# EAGLE design Contatore a relay 3bit - Product (EAGLE 9.6.2)
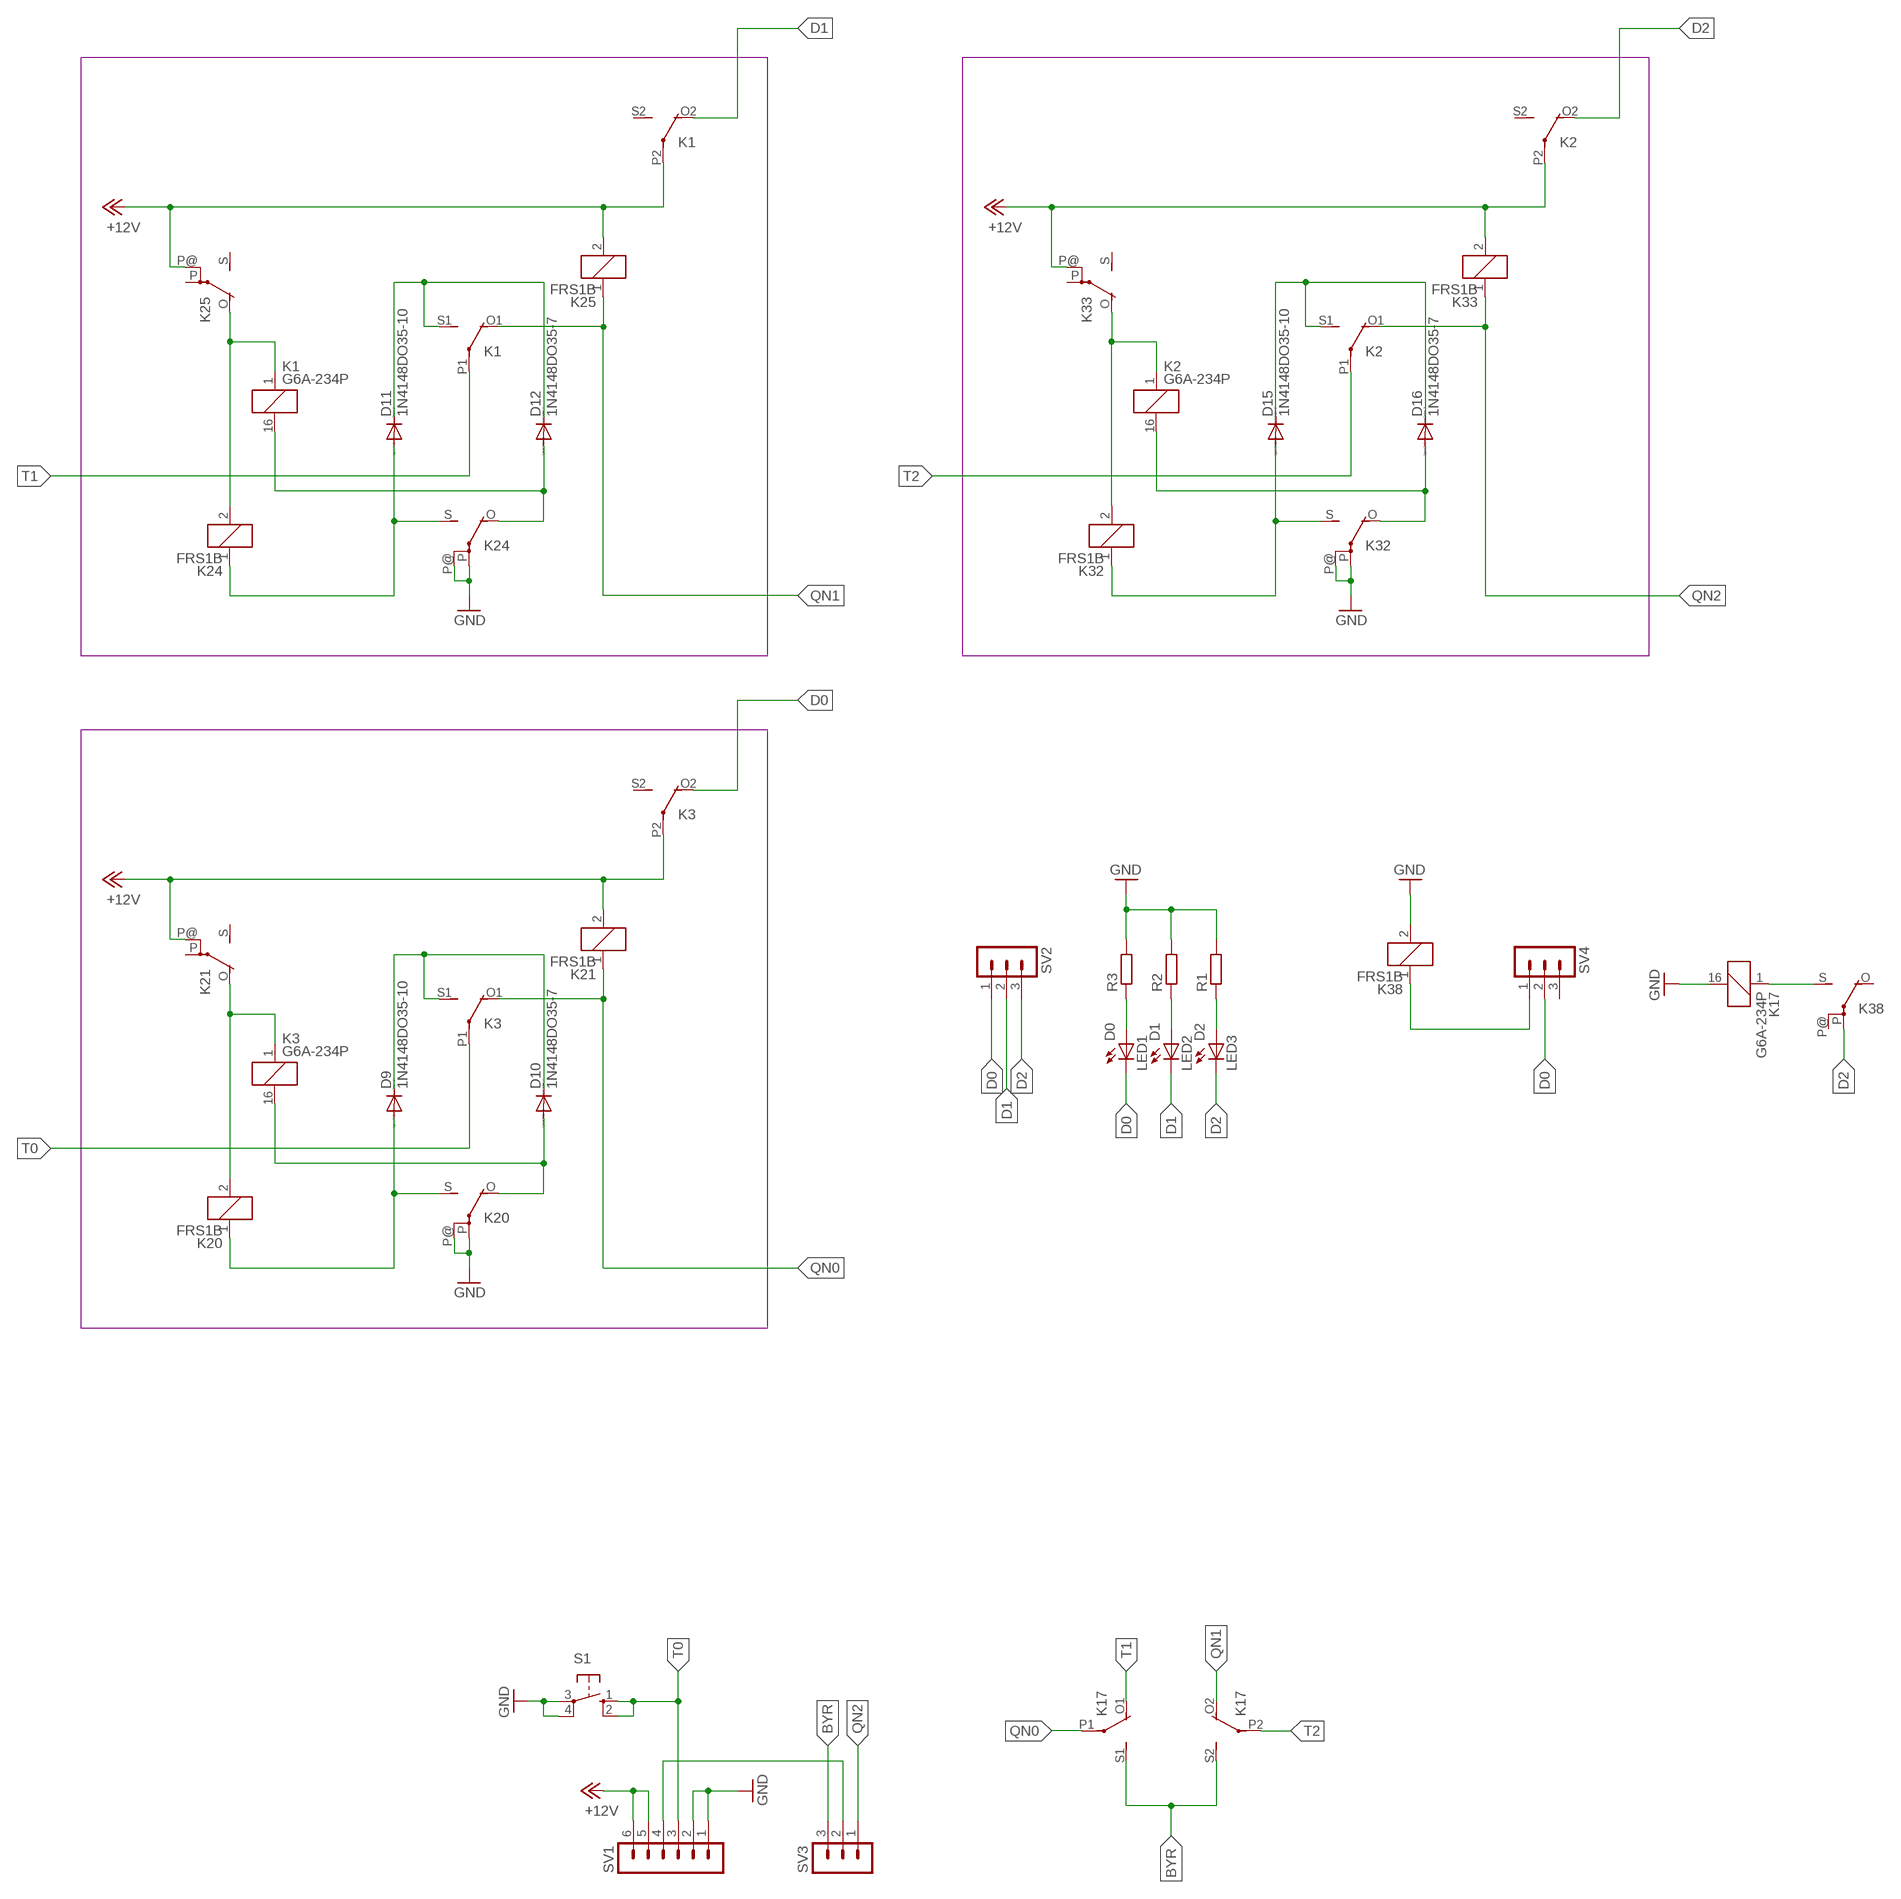
[diagram p0: schematic, sheet 1]

## Parts
D9  1N4148DO35-10  [DO35-10]
D10  1N4148DO35-7  [DO35-7]
D11  1N4148DO35-10  [DO35-10]
D12  1N4148DO35-7  [DO35-7]
D15  1N4148DO35-10  [DO35-10]
D16  1N4148DO35-7  [DO35-7]
K1  G6A-234P  [G6A-234P]
K2  G6A-234P  [G6A-234P]
K3  G6A-234P  [G6A-234P]
K17  G6A-234P  [G6A-234P]
K20  FRS1B  [FRS1B]
K21  FRS1B  [FRS1B]
K24  FRS1B  [FRS1B]
K25  FRS1B  [FRS1B]
K32  FRS1B  [FRS1B]
K33  FRS1B  [FRS1B]
K38  FRS1B  [FRS1B]
LED1  D0  LED3MM  [LED3MM]
LED2  D1  LED3MM  [LED3MM]
LED3  D2  LED3MM  [LED3MM]
R1  R-EU_M0805  [M0805]
R2  R-EU_M0805  [M0805]
R3  R-EU_M0805  [M0805]
S1  10-XX  [B3F-10XX]
SV1  MA06-1  [MA06-1]
SV2  MA03-1  [MA03-1]
SV3  MA03-1  [MA03-1]
SV4  MA03-1  [MA03-1]

## Nets
+12V: K1.P2(3:P) K2.P2(3:P) K3.P2(3:P) K21.2 K21.P@(2:P) K25.2 K25.P@(2:P) K33.2 K33.P@(2:P) SV1.5 SV1.6
BYR: K17.S1(2:S) K17.S2(3:S) SV3.3
D0: K3.O2(3:O) LED1.K(C) SV2.1 SV4.2
D1: K1.O2(3:O) LED2.K(C) SV2.2
D2: K2.O2(3:O) K38.P(2:P) LED3.K(C) SV2.3
GND: K17.16 K20.P(2:P) K20.P@(2:P) K24.P(2:P) K24.P@(2:P) K32.P(2:P) K32.P@(2:P) K38.2 R1.2 R2.2 R3.2 S1.3(P) S1.4(P1) SV1.1 SV1.2
N$1: SV1.4 SV3.2
N$2: K38.1 SV4.1
N$35: D10.A K3.16 K20.O(2:O)
N$36: D9.A K20.1 K20.S(2:S)
N$37: K3.1 K20.2 K21.O(2:O)
N$40: D9.C D10.C K3.S1(2:S)
N$42: D12.A K1.16 K24.O(2:O)
N$43: D11.A K24.1 K24.S(2:S)
N$44: K1.1 K24.2 K25.O(2:O)
N$47: D11.C D12.C K1.S1(2:S)
N$55: D16.A K2.16 K32.O(2:O)
N$56: D15.A K32.1 K32.S(2:S)
N$57: K2.1 K32.2 K33.O(2:O)
N$58: D15.C D16.C K2.S1(2:S)
N$61: K17.1 K38.S(2:S)
N$64: LED1.A R3.1
N$65: LED2.A R2.1
N$67: LED3.A R1.1
QN0: K3.O1(2:O) K17.P1(2:P) K21.1
QN1: K1.O1(2:O) K17.O2(3:O) K25.1
QN2: K2.O1(2:O) K33.1 SV3.1
T0: K3.P1(2:P) S1.1(S) S1.2(S1) SV1.3
T1: K1.P1(2:P) K17.O1(2:O)
T2: K2.P1(2:P) K17.P2(3:P)
Unconnected: K1.S2(3:S) K2.S2(3:S) K3.S2(3:S) K21.P(2:P) K21.S(2:S) K25.P(2:P) K25.S(2:S) K33.P(2:P) K33.S(2:S) K38.O(2:O) K38.P@(2:P) SV4.3

## Library data of the parts
D9-D12 D15 D16 = diode:1N4148: DIODE high speed (Philips)
K1-K3 K17 = relay:G6A-234P: RELAY 2 x switch, 0.3 A/125 V AC, 1 A/30 V DC, Omron; OC_FARNELL: unknown; OC_NEWARK: unknown
K20 K21 K24 K25 K32 K33 K38 = relay:FRS1B: RELAY 1 x switch, same as V23101-D6-A201, Siemens; OC_FARNELL: unknown; OC_NEWARK: unknown
LED1-LED3 = led:LED: LED OSRAM: - CHIPLED LG R971, LG N971, LY N971, LG Q971, LY Q971, LO R971, LY R971 LH N974, LH R974 LS Q976, LO Q976, LY Q976 LO Q996 - Hyper CHIPLED LW Q18S LB Q993, LB Q99A, LB R99A - SideLED LS A670, LO A670, LY A670, LG A670, LP A670 LB A673, LV A673, LT A673, LW A673 LH A674 LY A675 LS A676, LA A676, LO A676, LY A676, LW A676 LS A679, LY A679, LG A679 - Hyper Micro SIDELED® LS Y876, LA Y876, LO Y876, LY Y876 LT Y87S - SmartLED LW L88C, LW L88S LB L89C, LB L89S, LG L890 LS L89K, LO L89K, LY L89K LS L896, LA L896, LO L896, LY L896 - TOPLED LS T670, LO T670, LY T670, LG T670, LP T670 LSG T670, LSP T670, LSY T670, LOP T670, LYG T670 LG T671, LOG T671, LSG T671 LB T673, LV T673, LT T673, LW T673 LH T674 LS T676, LA T676, LO T676, LY T676, LB T676, LH T676, LSB T676, LW T676 LB T67C, LV T67C, LT T67C, LS T67K, LO T67K, LY T67K, LW E67C LS E67B, LA E67B, LO E67B, LY E67B, LB E67C, LV E67C, LT E67C LW T67C LS T679, LY T679, LG T679 LS T770, LO T770, LY T770, LG T770, LP T770 LB T773, LV T773, LT T773, LW T773 LH T774 LS E675, LA E675, LY E675, LS T675 LS T776, LA T776, LO T776, LY T776, LB T776 LHGB T686 LT T68C, LB T68C - Hyper Mini TOPLED® LB M676 - Mini TOPLED Santana® LG M470 LS M47K, LO M47K, LY M47K Source: http://www.osram.convergy.de LUXEON: - LUMILED® LXK2-PW12-R00, LXK2-PW12-S00, LXK2-PW14-U00, LXK2-PW14-V00 LXK2-PM12-R00, LXK2-PM12-S00, LXK2-PM14-U00 LXK2-PE12-Q00, LXK2-PE12-R00, LXK2-PE12-S00, LXK2-PE14-T00, LXK2-PE14-U00 LXK2-PB12-K00, LXK2-PB12-L00, LXK2-PB12-M00, LXK2-PB14-N00, LXK2-PB14-P00, LXK2-PB14-Q00 LXK2-PR12-L00, LXK2-PR12-M00, LXK2-PR14-Q00, LXK2-PR14-R00 LXK2-PD12-Q00, LXK2-PD12-R00, LXK2-PD12-S00 LXK2-PH12-R00, LXK2-PH12-S00 LXK2-PL12-P00, LXK2-PL12-Q00, LXK2-PL12-R00 Source: www.luxeon.com KINGBRIGHT: KA-3528ASYC Source: www.kingbright.com
R1-R3 = rcl:R-EU_: RESISTOR, European symbol
S1 = switch-omron:10-XX: OMRON SWITCH; MPN: B3F-1000; OC_FARNELL: 176432; OC_NEWARK: 36M3542
SV1 = con-lstb:MA06-1: PIN HEADER; OC_FARNELL: unknown; OC_NEWARK: unknown
SV2-SV4 = con-lstb:MA03-1: PIN HEADER; OC_FARNELL: unknown; OC_NEWARK: unknown

## Board
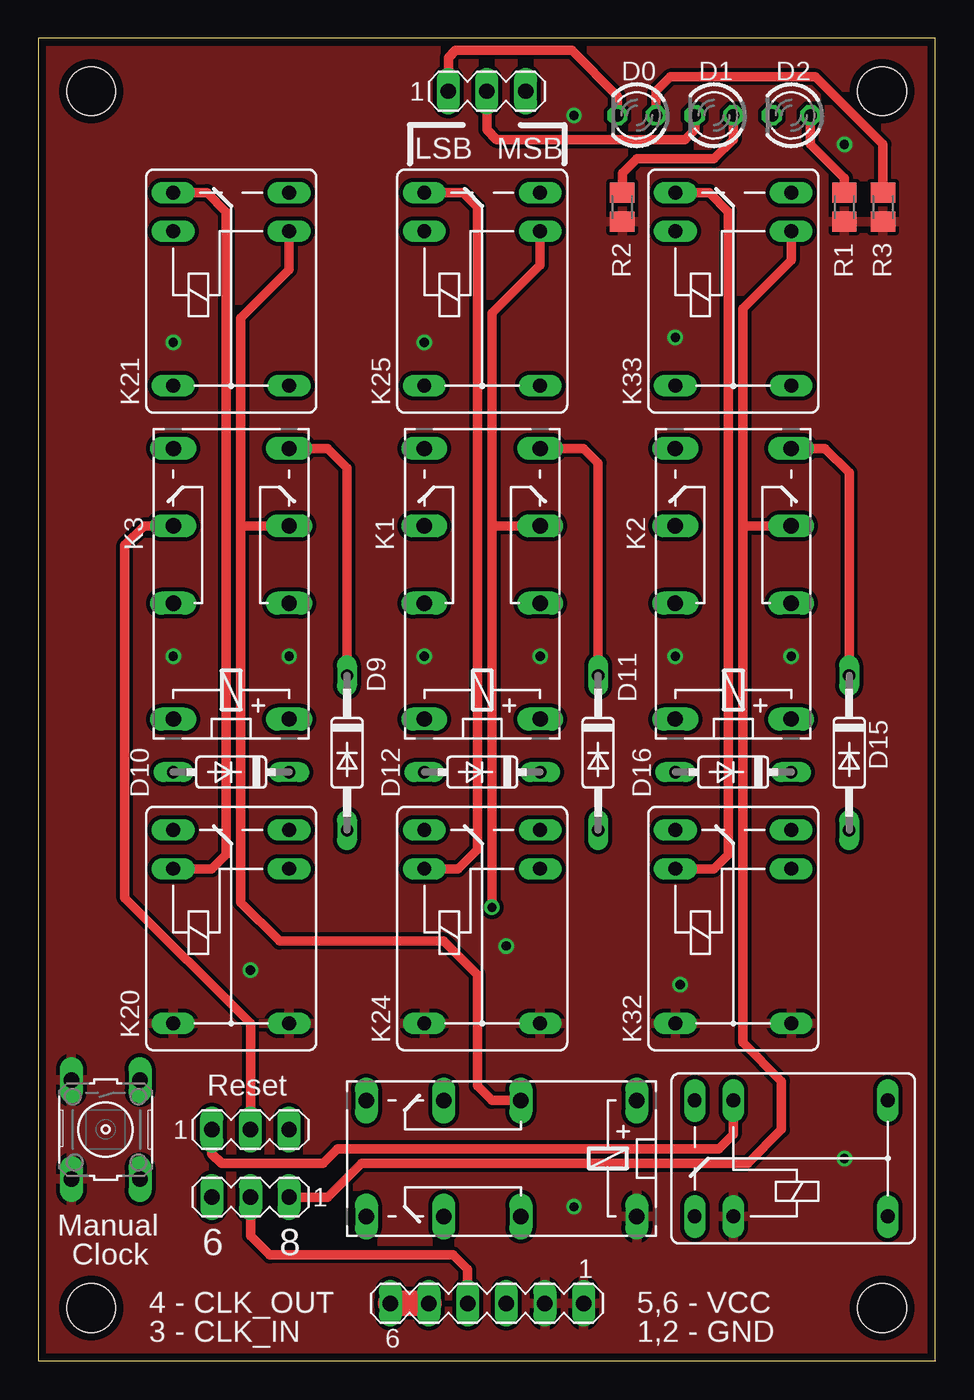
[diagram p1: board, top side]
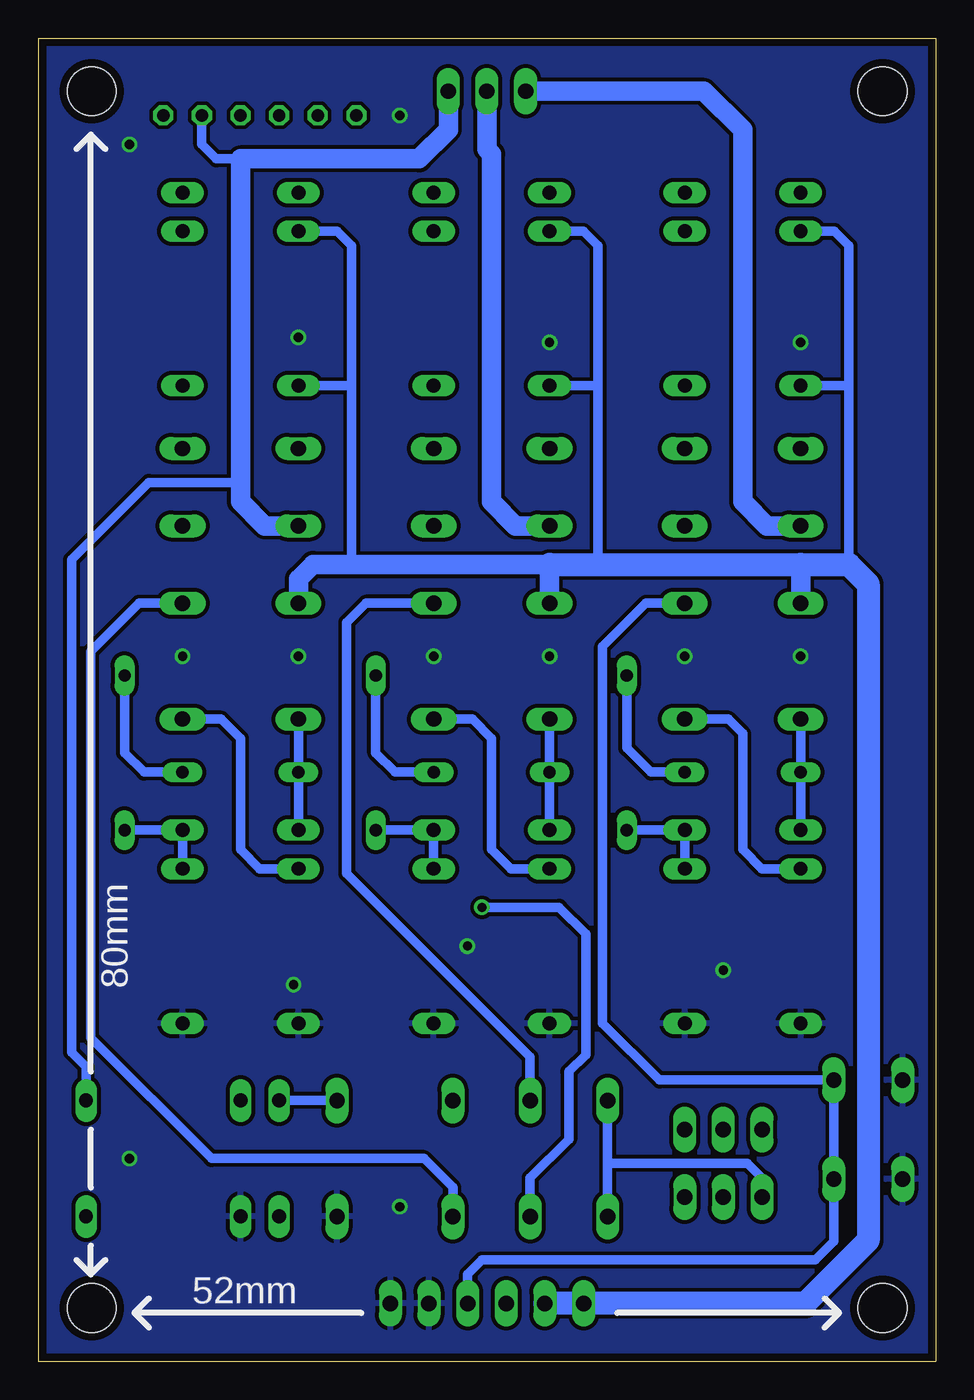
[diagram p2: board, bottom side, seen from below]

Size 59.03 x 87.01 mm. Coordinates in mm from the lower left corner, seen from the top.
Outline: 59,0.01 59,87.01 0,87.01 0,0.01
Outline: 59.03,0 0,0
Copper layers (1*16): Top 0.035mm / dielectric 1.5mm / Bottom 0.035mm
Design rules "default *": minimum track width 10mil, minimum drill 24mil, track to track 8mil, track to pad 8mil, pad to pad 8mil, via to via 8mil, smd to smd 8mil, copper to edge 20mil, drill to drill 8mil, minimum pad ring 10mil, minimum via ring 8mil, stop-mask expansion 4mil, vias tented up to drill 0mil, thermal gap 10mil
Holes 3.2 mm at 3.5,3.51 55.5,3.51 55.5,83.51 3.5,83.51

### Footprints (pad centres in the part's own frame; a part is rotated, then mirrored left to right if it is on the bottom)
DO35-10 = drill 0.813 long: A 5.08,0; C -5.08,0
DO35-7 = drill 0.813 long: A 3.81,0; C -3.81,0
G6A-234P = drill 1.016 long: 1 -3.81,-3.81; 16 -3.81,3.81; O1 8.89,-3.81; O2 8.89,3.81; P1 3.81,-3.81; P2 3.81,3.81; S1 13.97,-3.81; S2 13.97,3.81
FRS1B = drill 0.914 long: 1 0,3.81; 2 0,-3.81; O -2.54,-3.81; P 10.16,3.81; P@ 10.16,-3.81; S -2.54,3.81
LED3MM = drill 0.813 octagon: A -1.27,0; K 1.27,0
M0805 = smd 1.3 x 1.6: 1 -0.95,0; 2 0.95,0
B3F-10XX = drill 1.016 long: 1 -3.251,2.261; 2 3.251,2.261; 3 -3.251,-2.261; 4 3.251,-2.261
MA06-1 = drill 1.016 long: 1 -6.35,0; 2 -3.81,0; 3 -1.27,0; 4 1.27,0; 5 3.81,0; 6 6.35,0
MA03-1 = drill 1.016 long: 1 -2.54,0; 2 0,0; 3 2.54,0

### Placement (x,y rotation side)
D9  20.32,40.02 270 top
D10  12.7,38.75 180 top
D11  36.83,40.02 270 top
D12  29.21,38.75 180 top
D15  53.34,40.02 270 top
D16  45.72,38.75 180 top
K1  29.21,46.05 90 top
K2  45.72,46.05 90 top
K3  12.7,46.05 90 top
K17  35.56,13.35 180 top
K20  12.7,32.4 270 top
K21  12.7,74.31 270 top
K24  29.21,32.4 270 top
K25  29.21,74.31 270 top
K32  45.72,32.4 270 top
K33  45.72,74.31 270 top
K38  45.72,13.35 0 top
LED1  39.37,81.93 180 top
LED2  44.45,81.93 180 top
LED3  49.53,81.93 180 top
R1  53.02,75.89 270 top
R2  38.42,75.89 270 top
R3  55.56,75.89 270 top
S1  4.45,15.25 270 top
SV1  29.52,3.82 180 top
SV2  29.52,83.52 0 top
SV3  13.97,10.81 180 top
SV4  13.97,15.25 0 top

### Tracks (layer width: path | path; a pad name or v marks a point on that pad's centre or on a via)
+12V
  Top 1.676: SV1.5 SV1.6
  Bottom 0.61: K21.2 6.67,74.31 5.71,73.36 5.71,64.15 | 5.71,64.15 5.71,52.4 | K25.2 23.18,74.31 22.23,73.36 22.23,64.15 | 22.23,64.15 22.23,52.4 | K33.2 39.37,74.31 38.42,73.36 38.42,64.15 | 38.42,64.15 38.42,52.4 | K33.P@ 38.42,64.15 | K25.P@ 22.23,64.15 | K21.P@ 5.71,64.15
  Bottom 1.27: K2.P2 41.91,51.45 40.96,52.4 38.42,52.4 25.4,52.4 K1.P2 | K3.P2 8.89,52.4
  Bottom 1.5: 25.4,52.4 22.23,52.4 8.89,52.4 5.71,52.4 4.45,51.13 4.45,7.95 8.57,3.82 SV1.5
BYR
  Bottom 0.61: 21.59,13.03 12.38,13.03 11.43,12.08 SV3.3 | 21.59,13.03 K17.S2 | K17.S1 21.59,13.03
D0
  Top 0.61: SV4.2 13.97,22.24 5.71,30.49 5.71,53.67 6.99,54.94 K3.O2 | SV2.1 26.98,85.73 27.45,86.2 35.1,86.2 38.1,83.2 LED1.K
  Bottom 1.27: K3.O2 11.11,54.94 12.7,56.53 12.7,80.98 15.24,83.51 SV2.1
D1
  Top 0.61: SV2.2 29.52,80.98 30.16,80.34 42.55,80.34 43.18,80.98 LED2.K
  Bottom 1.27: K1.O2 27.62,54.94 29.21,56.53 29.21,79.39 29.53,79.7 SV2.2
D2
  Bottom 0.61: K38.P 55.88,19.38 56.83,20.33 56.83,52.72 51.75,57.8 45.72,57.8 | 45.72,79.07 47.31,79.07 48.26,80.02 LED3.K
  Bottom 1.27: K2.O2 44.13,54.94 45.72,56.53 45.72,57.8 45.72,79.07 33.97,79.07 32.06,80.98 SV2.3
GND  (via drill 0.61)
  other vias: 25.4,67.01 35.24,81.93 53.02,80.02 8.89,67.01 41.91,67.32 41.91,46.37 33.02,46.37 49.53,46.37 25.4,46.37 16.51,46.37 8.89,46.37 13.97,25.73 30.8,27.32 42.23,24.78 53.02,13.35 35.24,10.17
  pour Bottom (isolate 0.254): -2,-1.99 61,-1.99 61,89.01 -2,89.01
  pour Top (isolate 0.254): -4,-3.99 -4,91.01 63,91.01 63,-3.99
N$1
  Top 0.61: SV1.4 28.25,6.06 27.3,7 15.24,7 13.97,8.27 SV3.2
N$2
  Top 0.61: K38.1 45.72,14.93 44.77,13.98 19.68,13.98 18.73,13.03 12.06,13.03 11.43,13.66 SV4.1
N$35
  Bottom 0.61: K20.O D10.A K3.16
N$36
  Bottom 0.61: K20.1 K20.S D9.A
N$37
  Top 0.61: K21.O 11.11,76.85 12.38,75.58 12.38,33.35 11.43,32.4 K20.2
  Bottom 0.61: K20.2 11.43,32.4 12.7,33.67 12.7,41.29 13.65,42.24 K3.1
N$40
  Top 0.61: D9.C 20.32,58.75 19.05,60.02 K3.S1
  Bottom 0.61: D10.C 18.73,38.75 20.32,40.33 D9.C
N$42
  Bottom 0.61: K24.O D12.A K1.16
N$43
  Bottom 0.61: K24.1 K24.S D11.A
N$44
  Top 0.61: K25.O 27.94,76.85 28.89,75.89 28.89,33.67 27.62,32.4 K24.2
  Bottom 0.61: K24.2 27.94,32.4 29.21,33.67 29.21,40.97 30.48,42.24 K1.1
N$47
  Top 0.61: D11.C 36.83,59.07 35.88,60.02 K1.S1
  Bottom 0.61: D12.C 35.56,38.75 36.83,40.02 D11.C
N$55
  Bottom 0.61: K32.O D16.A K2.16
N$56
  Bottom 0.61: K32.1 K32.S D15.A
N$57
  Top 0.61: K32.2 44.45,32.4 45.4,33.35 45.4,75.58 44.13,76.85 K33.O
  Bottom 0.61: K32.2 44.45,32.4 45.72,33.67 45.72,40.97 46.99,42.24 K2.1
N$58
  Top 0.61: D15.C 53.34,58.43 51.75,60.02 K2.S1
  Bottom 0.61: D16.C 52.07,38.75 53.34,40.02 D15.C
N$61
  Bottom 0.61: K17.1 K38.S
N$64
  Top 0.61: R3.1 55.56,80.02 51.12,84.47 41.59,84.47 40.64,83.51 LED1.A
N$65
  Top 0.61: LED2.A 45.72,80.34 44.45,79.07 39.37,79.07 38.42,78.12 R2.1
N$67
  Top 0.61: R1.1 53.02,77.8 50.8,80.02 LED3.A
QN0
  Top 0.61: K21.1 16.51,71.77 13.34,68.59 13.34,54.94 | 13.34,54.94 K3.O1 | K17.P1 29.84,17.16 28.89,18.11 28.89,25.41 26.67,27.63 15.88,27.63 13.34,30.18 13.34,54.94
QN1  (via drill 0.61 pad 0.55)
  Top 0.61: K25.1 33.02,72.09 29.84,68.91 29.84,54.94 | K1.O1 29.84,54.94 | 29.84,54.94 v29.84,29.86
  Bottom 0.61: 26.67,8.9 K17.O2 26.67,12.08 24.13,14.62 24.13,19.06 23.02,20.17 23.02,28.11 24.77,29.86 v29.84,29.86
QN2
  Top 0.61: SV3.1 19.05,10.81 21.27,13.03 46.67,13.03 48.9,15.25 48.9,18.43 46.35,20.97 46.35,54.94 | K33.1 49.53,72.4 46.35,69.23 46.35,54.94 | 46.35,54.94 K2.O1
T0
  Bottom 0.61: SV1.3 30.79,5.74 29.84,6.68 7.94,6.68 6.71,7.91 S1.2 S1.1 18.17,18.5 21.91,22.24 21.91,47 19.05,49.86 K3.P1
T1
  Bottom 0.61: K1.P1 37.47,49.86 38.73,48.59 38.73,32.08 26.67,20.02 K17.O1
T2
  Bottom 0.61: K17.P2 31.75,11.44 33.66,13.35 47.62,13.35 55.56,21.29 55.56,46.68 52.39,49.86 K2.P1

### Text on the board
tNames: LSB | MSB | Reset | Manual | 6 | 8 | Clock | 4 - CLK_OUT | 5,6 - VCC | 3 - CLK_IN | 1,2 - GND
bNames: 80mm | 52mm